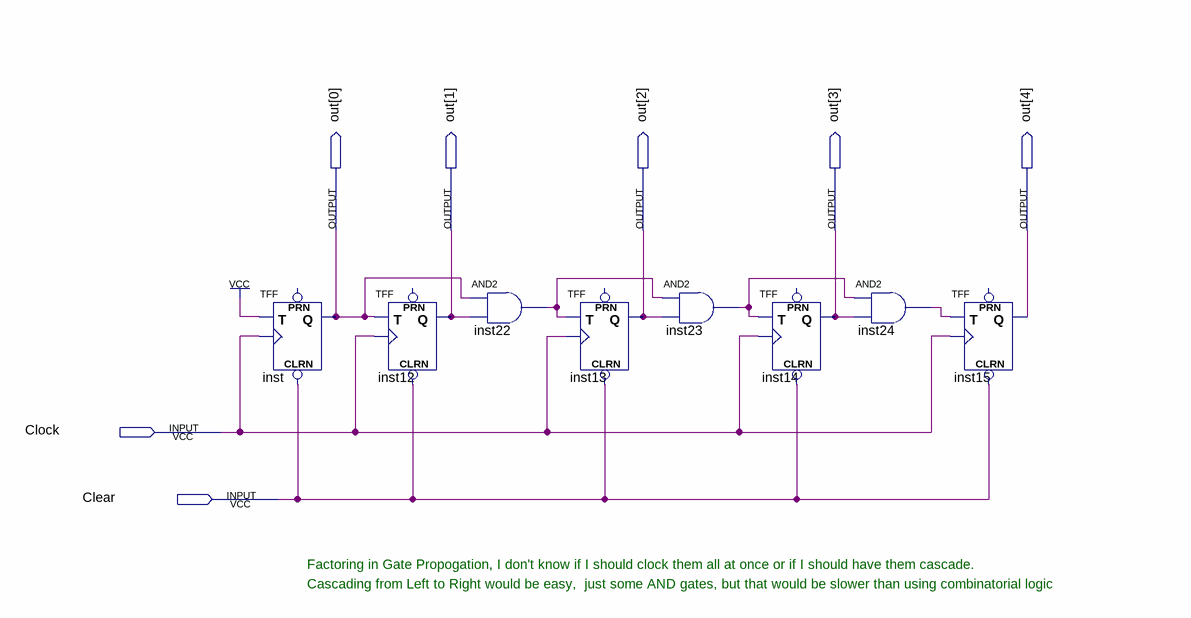
[diagram p0: schematic sheet]
// Quartus schematic counter5bit.bdf as structural Verilog: 8 symbols, 7 pins
module counter5bit (
  input  Clock,
  input  Clear,
  output [4:0] out
);

  wire inst22_out, inst23_out, inst24_out;

  TFF inst (.CLRN(Clear), .T(1'b1), .CLK(Clock), .Q(out[0]));  // open: PRN
  TFF inst12 (.CLRN(Clear), .T(out[0]), .CLK(Clock), .Q(out[1]));  // open: PRN
  and inst22 (inst22_out, out[0], out[1]);
  TFF inst13 (.CLRN(Clear), .T(inst22_out), .CLK(Clock), .Q(out[2]));  // open: PRN
  and inst23 (inst23_out, inst22_out, out[2]);
  TFF inst14 (.CLRN(Clear), .T(inst23_out), .CLK(Clock), .Q(out[3]));  // open: PRN
  and inst24 (inst24_out, inst23_out, out[3]);
  TFF inst15 (.CLRN(Clear), .T(inst24_out), .CLK(Clock), .Q(out[4]));  // open: PRN

  // Notes on the sheet:
  //   Factoring in Gate Propogation, I don't know if I should clock them all at once or if I should have them cascade.
  //   Cascading from Left to Right would be easy,  just some AND gates, but that would be slower than using combinatorial logic
endmodule
